# EAGLE schematic Schematic (EAGLE 6.5.0)
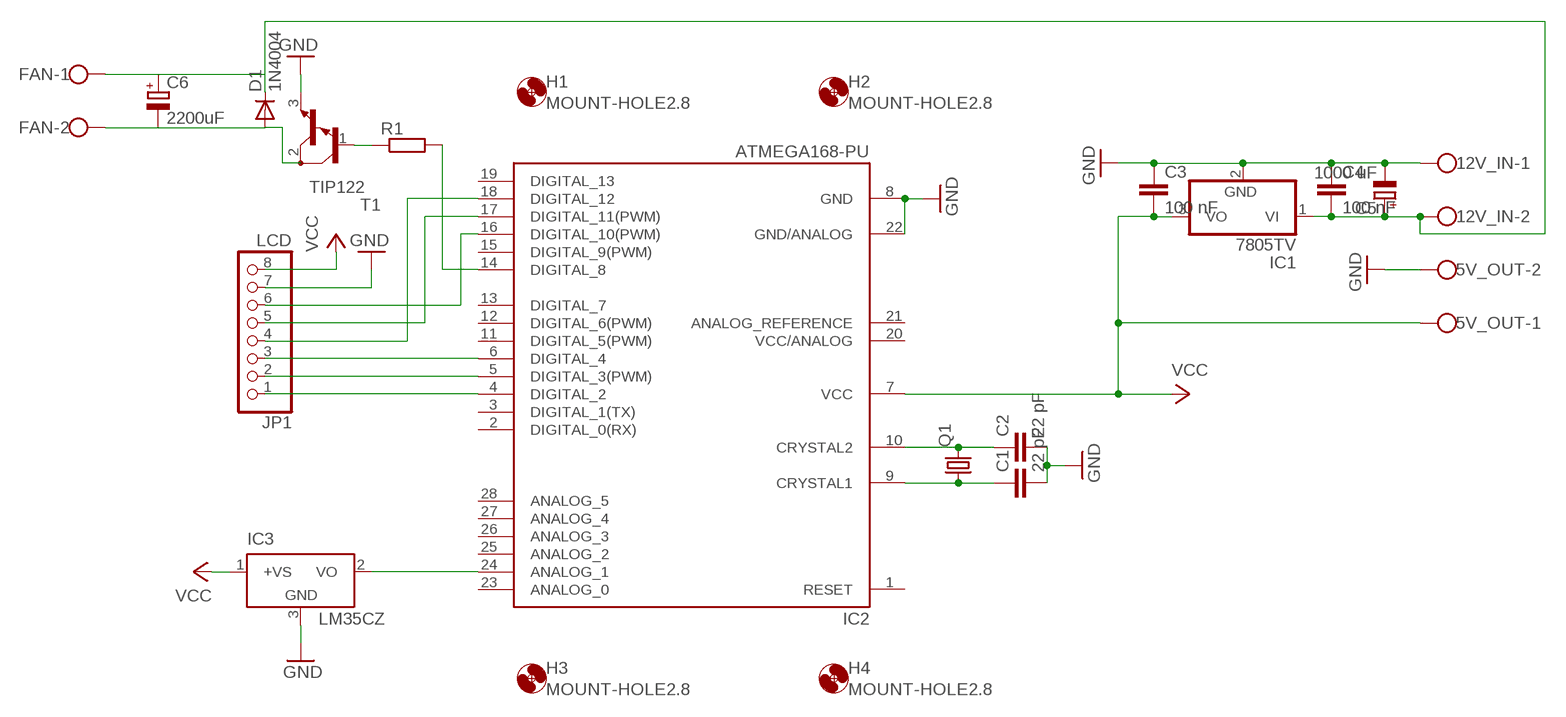
[diagram p0: schematic, sheet 1]

## Parts
5V_OUT  W237-102  [W237-102]
12V_IN  W237-102  [W237-102]
C1  22 pF  C2,5-3  [C2.5-3]
C2  22 pF  C2,5-3  [C2.5-3]
C3  100 nF  C2,5-3  [C2.5-3]
C4  100 nF  C2,5-3  [C2.5-3]
C5  1000 uF  CPOL-EUE3.5-8  [E3,5-8]
C6  2200uF  CPOL-EUE3.5-10  [E3,5-10]
D1  1N4004  [DO41-10]
FAN  W237-102  [W237-102]
H1  MOUNT-HOLE2.8  [2,8]
H2  MOUNT-HOLE2.8  [2,8]
H3  MOUNT-HOLE2.8  [2,8]
H4  MOUNT-HOLE2.8  [2,8]
IC1  7805TV  [TO220V]
IC2  ATMEGA168-PU  [DIL28-3]
IC3  LM35CZ  [TO92]
JP1  LCD  PINHD-1X8  [1X08]
Q1  CRYSTALHC49U-V  [HC49U-V]
R1  R-EU_0207/10  [0207/10]
T1  TIP122  [TO220]

## Nets
GND: 5V_OUT.2 C1.2 C2.2 IC2.8(GND) IC2.22(GND/ANALOG) IC3.3(GND) JP1.7 T1.3(E)
N$1: C1.1 IC2.9(CRYSTAL1) Q1.1
N$2: IC2.16(DIGITAL_10(PWM)) JP1.6
N$3: C6.- D1.A FAN.2 T1.2(C)
N$4: C2.1 IC2.10(CRYSTAL2) Q1.2
N$5: 12V_IN.1 C3.1 C4.1 C5.- IC1.2(GND)
N$6: IC2.4(DIGITAL_2) JP1.1
N$7: IC2.5(DIGITAL_3(PWM)) JP1.2
N$8: IC2.6(DIGITAL_4) JP1.3
N$9: R1.1 T1.1(B)
N$10: IC2.17(DIGITAL_11(PWM)) JP1.5
N$11: IC2.18(DIGITAL_12) JP1.4
N$12: IC2.14(DIGITAL_8) R1.2
N$14: IC2.24(ANALOG_1) IC3.2(VO)
N$18: 12V_IN.2 C4.2 C5.+ C6.+ D1.C FAN.1 IC1.1(VI)
VCC: 5V_OUT.1 C3.2 IC1.3(VO) IC2.7(VCC) IC3.1(+VS) JP1.8
Unconnected: IC2.1(RESET) IC2.2(DIGITAL_0(RX)) IC2.3(DIGITAL_1(TX)) IC2.11(DIGITAL_5(PWM)) IC2.12(DIGITAL_6(PWM)) IC2.13(DIGITAL_7) IC2.15(DIGITAL_9(PWM)) IC2.19(DIGITAL_13) IC2.20(VCC/ANALOG) IC2.21(ANALOG_REFERENCE) IC2.23(ANALOG_0) IC2.25(ANALOG_2) IC2.26(ANALOG_3) IC2.27(ANALOG_4) IC2.28(ANALOG_5)

## Library data of the parts
5V_OUT 12V_IN FAN = con-wago-500:W237-102: WAGO SCREW CLAMP; MPN: 237-102; OC_FARNELL: unknown; OC_NEWARK: 70K9898
C1-C4 = capacitor-wima:C: CAPACITOR naming: grid - package width
C5 = rcl:CPOL-EU: POLARIZED CAPACITOR, European symbol
C6 = resistor:CPOL-EU: POLARIZED CAPACITOR, European symbol
D1 = diode:1N4004: DIODE general purpose rectifier, 1 A
H1-H4 = holes:MOUNT-HOLE: MOUNTING HOLE with drill center marker
IC1 = linear:78*: Positive VOLTAGE REGULATOR Source: http://cache.national.com/ds/LM/LM78L05.pdf http://www.fairchildsemi.com/ds/LM/LM7805.pdf
IC2 = Arduino-AVR:ATMEGA168-PU
IC3 = lm35:LM35: Single-Supply Centigrade Temperature Sensor Vout = (10mV/°C x Temp °C) +5mmmV Source: http://www.national.com/ds/LM/LM35.pdf
JP1 = pinhead:PINHD-1X8: PIN HEADER
Q1 = crystal:CRYSTAL: CRYSTAL; OC_FARNELL: 1666969; OC_NEWARK: unknown
R1 = rcl:R-EU_: RESISTOR, European symbol
T1 = transistor:TIP122: NPN BIPOLAR DARLINGTON TRANSISTOR